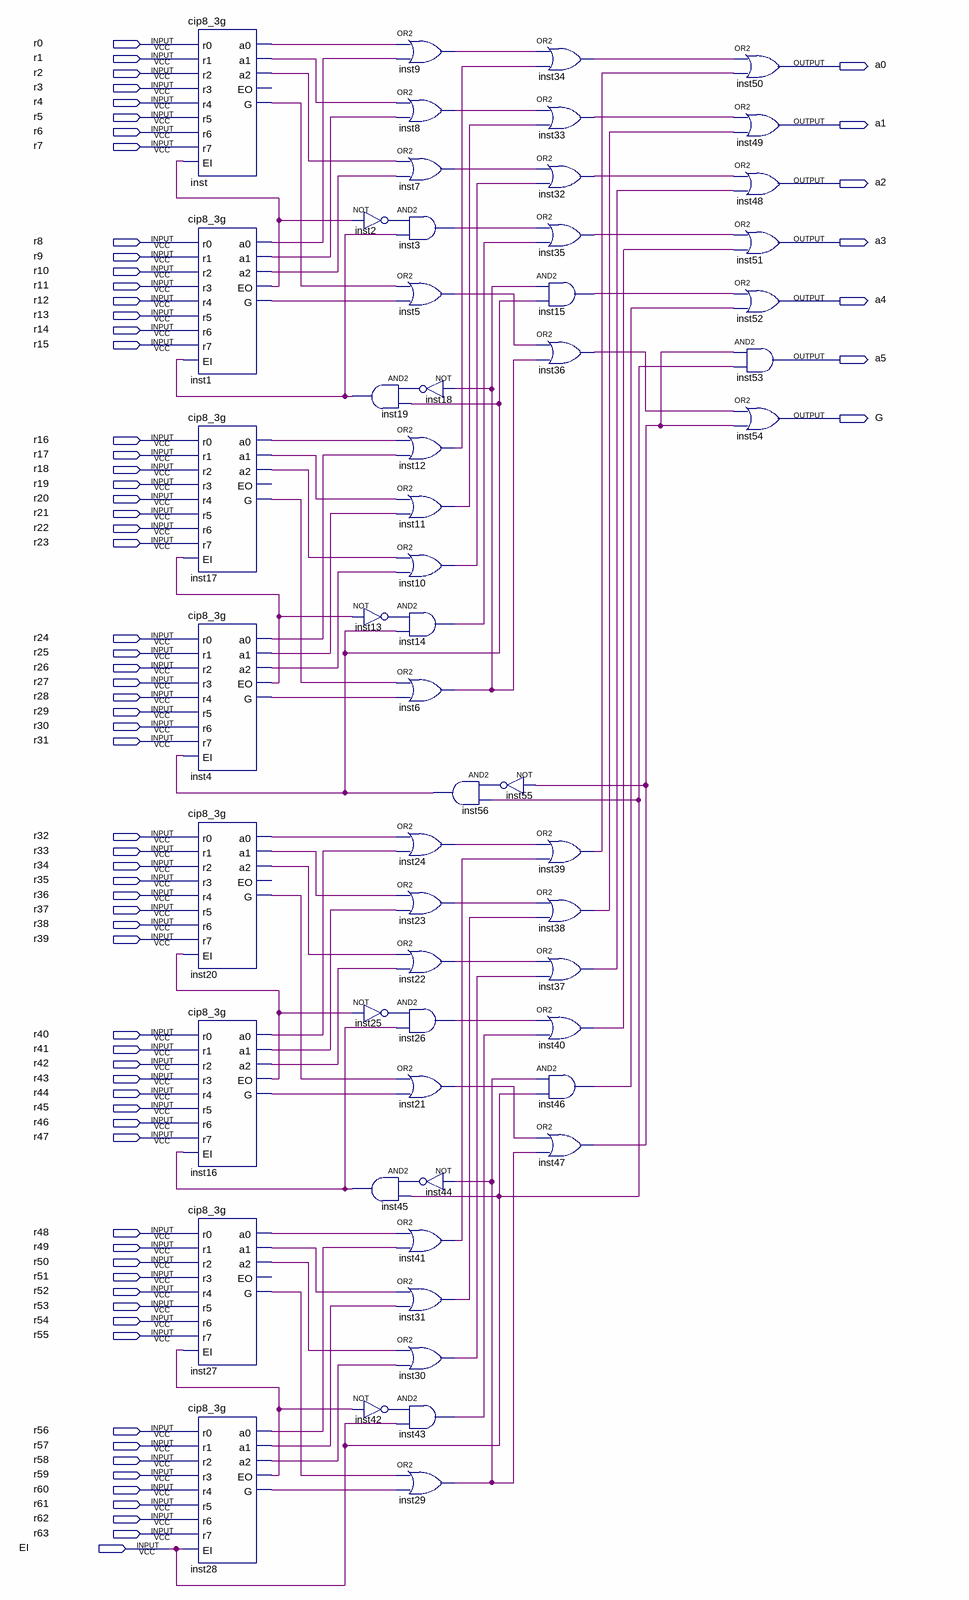
[diagram p0: schematic sheet]
// Quartus schematic cip64_6g.bdf as structural Verilog: 57 symbols, 72 pins
module cip64_6g (
  input  r0,
  input  r1,
  input  r2,
  input  r3,
  input  r4,
  input  r5,
  input  r6,
  input  r7,
  input  r8,
  input  r9,
  input  r10,
  input  r11,
  input  r12,
  input  r13,
  input  r14,
  input  r15,
  input  r16,
  input  r17,
  input  r18,
  input  r19,
  input  r20,
  input  r21,
  input  r22,
  input  r23,
  input  r24,
  input  r25,
  input  r26,
  input  r27,
  input  r28,
  input  r29,
  input  r30,
  input  r31,
  input  r32,
  input  r33,
  input  r34,
  input  r35,
  input  r36,
  input  r37,
  input  r38,
  input  r39,
  input  r40,
  input  r41,
  input  r42,
  input  r43,
  input  r44,
  input  r45,
  input  r46,
  input  r47,
  input  r48,
  input  r49,
  input  r50,
  input  r51,
  input  r52,
  input  r53,
  input  r54,
  input  r55,
  input  r56,
  input  r57,
  input  r58,
  input  r59,
  input  r60,
  input  r61,
  input  r62,
  input  r63,
  input  EI,
  output a0,
  output a1,
  output a2,
  output a3,
  output a4,
  output a5,
  output G
);

  wire inst1_a0, inst1_a1, inst1_a2, inst1_eo, inst1_g, inst2_out, inst3_out, inst4_a0, inst4_a1, inst4_a2,
       inst4_eo, inst4_g, inst5_out, inst6_out, inst7_out, inst8_out, inst9_out, inst10_out, inst11_out,
       inst12_out, inst13_out, inst14_out, inst15_out, inst16_a0, inst16_a1, inst16_a2, inst16_eo, inst16_g,
       inst17_a0, inst17_a1, inst17_a2, inst17_g, inst18_out, inst19_out, inst20_a0, inst20_a1, inst20_a2,
       inst20_g, inst21_out, inst22_out, inst23_out, inst24_out, inst25_out, inst26_out, inst27_a0,
       inst27_a1, inst27_a2, inst27_g, inst28_a0, inst28_a1, inst28_a2, inst28_eo, inst28_g, inst29_out,
       inst30_out, inst31_out, inst32_out, inst33_out, inst34_out, inst35_out, inst36_out, inst37_out,
       inst38_out, inst39_out, inst40_out, inst41_out, inst42_out, inst43_out, inst44_out, inst45_out,
       inst46_out, inst47_out, inst55_out, inst56_out, inst_a0, inst_a1, inst_a2, inst_g;

  cip8_3g inst (
    .r0(r0), .r1(r1), .r2(r2), .r3(r3), .r4(r4), .r5(r5), .r6(r6), .r7(r7), .EI(inst1_eo), .a0(inst_a0),
    .a1(inst_a1), .a2(inst_a2), .G(inst_g));  // open: EO
  cip8_3g inst1 (
    .r0(r8), .r1(r9), .r2(r10), .r3(r11), .r4(r12), .r5(r13), .r6(r14), .r7(r15), .EI(inst19_out),
    .a0(inst1_a0), .a1(inst1_a1), .a2(inst1_a2), .EO(inst1_eo), .G(inst1_g));
  cip8_3g inst17 (
    .r0(r16), .r1(r17), .r2(r18), .r3(r19), .r4(r20), .r5(r21), .r6(r22), .r7(r23), .EI(inst4_eo),
    .a0(inst17_a0), .a1(inst17_a1), .a2(inst17_a2), .G(inst17_g));  // open: EO
  cip8_3g inst4 (
    .r0(r24), .r1(r25), .r2(r26), .r3(r27), .r4(r28), .r5(r29), .r6(r30), .r7(r31), .EI(inst56_out),
    .a0(inst4_a0), .a1(inst4_a1), .a2(inst4_a2), .EO(inst4_eo), .G(inst4_g));
  cip8_3g inst20 (
    .r0(r32), .r1(r33), .r2(r34), .r3(r35), .r4(r36), .r5(r37), .r6(r38), .r7(r39), .EI(inst16_eo),
    .a0(inst20_a0), .a1(inst20_a1), .a2(inst20_a2), .G(inst20_g));  // open: EO
  cip8_3g inst16 (
    .r0(r40), .r1(r41), .r2(r42), .r3(r43), .r4(r44), .r5(r45), .r6(r46), .r7(r47), .EI(inst45_out),
    .a0(inst16_a0), .a1(inst16_a1), .a2(inst16_a2), .EO(inst16_eo), .G(inst16_g));
  cip8_3g inst27 (
    .r0(r48), .r1(r49), .r2(r50), .r3(r51), .r4(r52), .r5(r53), .r6(r54), .r7(r55), .EI(inst28_eo),
    .a0(inst27_a0), .a1(inst27_a1), .a2(inst27_a2), .G(inst27_g));  // open: EO
  cip8_3g inst28 (
    .r0(r56), .r1(r57), .r2(r58), .r3(r59), .r4(r60), .r5(r61), .r6(r62), .r7(r63), .EI(EI), .a0(inst28_a0),
    .a1(inst28_a1), .a2(inst28_a2), .EO(inst28_eo), .G(inst28_g));
  not inst2 (inst2_out, inst1_eo);
  and inst19 (inst19_out, inst18_out, inst56_out);
  not inst13 (inst13_out, inst4_eo);
  not inst25 (inst25_out, inst16_eo);
  and inst45 (inst45_out, inst44_out, EI);
  not inst42 (inst42_out, inst28_eo);
  or inst9 (inst9_out, inst_a0, inst1_a0);
  or inst8 (inst8_out, inst_a1, inst1_a1);
  or inst7 (inst7_out, inst_a2, inst1_a2);
  and inst3 (inst3_out, inst2_out, inst19_out);
  or inst5 (inst5_out, inst_g, inst1_g);
  not inst18 (inst18_out, inst6_out);
  or inst12 (inst12_out, inst17_a0, inst4_a0);
  or inst11 (inst11_out, inst17_a1, inst4_a1);
  or inst10 (inst10_out, inst17_a2, inst4_a2);
  and inst14 (inst14_out, inst13_out, inst56_out);
  or inst6 (inst6_out, inst17_g, inst4_g);
  and inst56 (inst56_out, inst55_out, EI);
  or inst24 (inst24_out, inst20_a0, inst16_a0);
  or inst23 (inst23_out, inst20_a1, inst16_a1);
  or inst22 (inst22_out, inst20_a2, inst16_a2);
  and inst26 (inst26_out, inst25_out, inst45_out);
  or inst21 (inst21_out, inst20_g, inst16_g);
  not inst44 (inst44_out, inst29_out);
  or inst41 (inst41_out, inst27_a0, inst28_a0);
  or inst31 (inst31_out, inst27_a1, inst28_a1);
  or inst30 (inst30_out, inst27_a2, inst28_a2);
  and inst43 (inst43_out, inst42_out, EI);
  or inst29 (inst29_out, inst27_g, inst28_g);
  not inst55 (inst55_out, inst47_out);
  or inst34 (inst34_out, inst9_out, inst12_out);
  or inst33 (inst33_out, inst8_out, inst11_out);
  or inst32 (inst32_out, inst7_out, inst10_out);
  or inst35 (inst35_out, inst3_out, inst14_out);
  and inst15 (inst15_out, inst6_out, inst56_out);
  or inst36 (inst36_out, inst5_out, inst6_out);
  or inst39 (inst39_out, inst24_out, inst41_out);
  or inst38 (inst38_out, inst23_out, inst31_out);
  or inst37 (inst37_out, inst22_out, inst30_out);
  or inst40 (inst40_out, inst26_out, inst43_out);
  and inst46 (inst46_out, inst29_out, EI);
  or inst47 (inst47_out, inst21_out, inst29_out);
  or inst50 (a0, inst34_out, inst39_out);
  or inst49 (a1, inst33_out, inst38_out);
  or inst48 (a2, inst32_out, inst37_out);
  or inst51 (a3, inst35_out, inst40_out);
  or inst52 (a4, inst15_out, inst46_out);
  and inst53 (a5, inst47_out, EI);
  or inst54 (G, inst36_out, inst47_out);
endmodule
